# EAGLE design ETAG_v8_u2270b_AOS2017 (EAGLE 7.5.0)

## Sheet 1 of 2
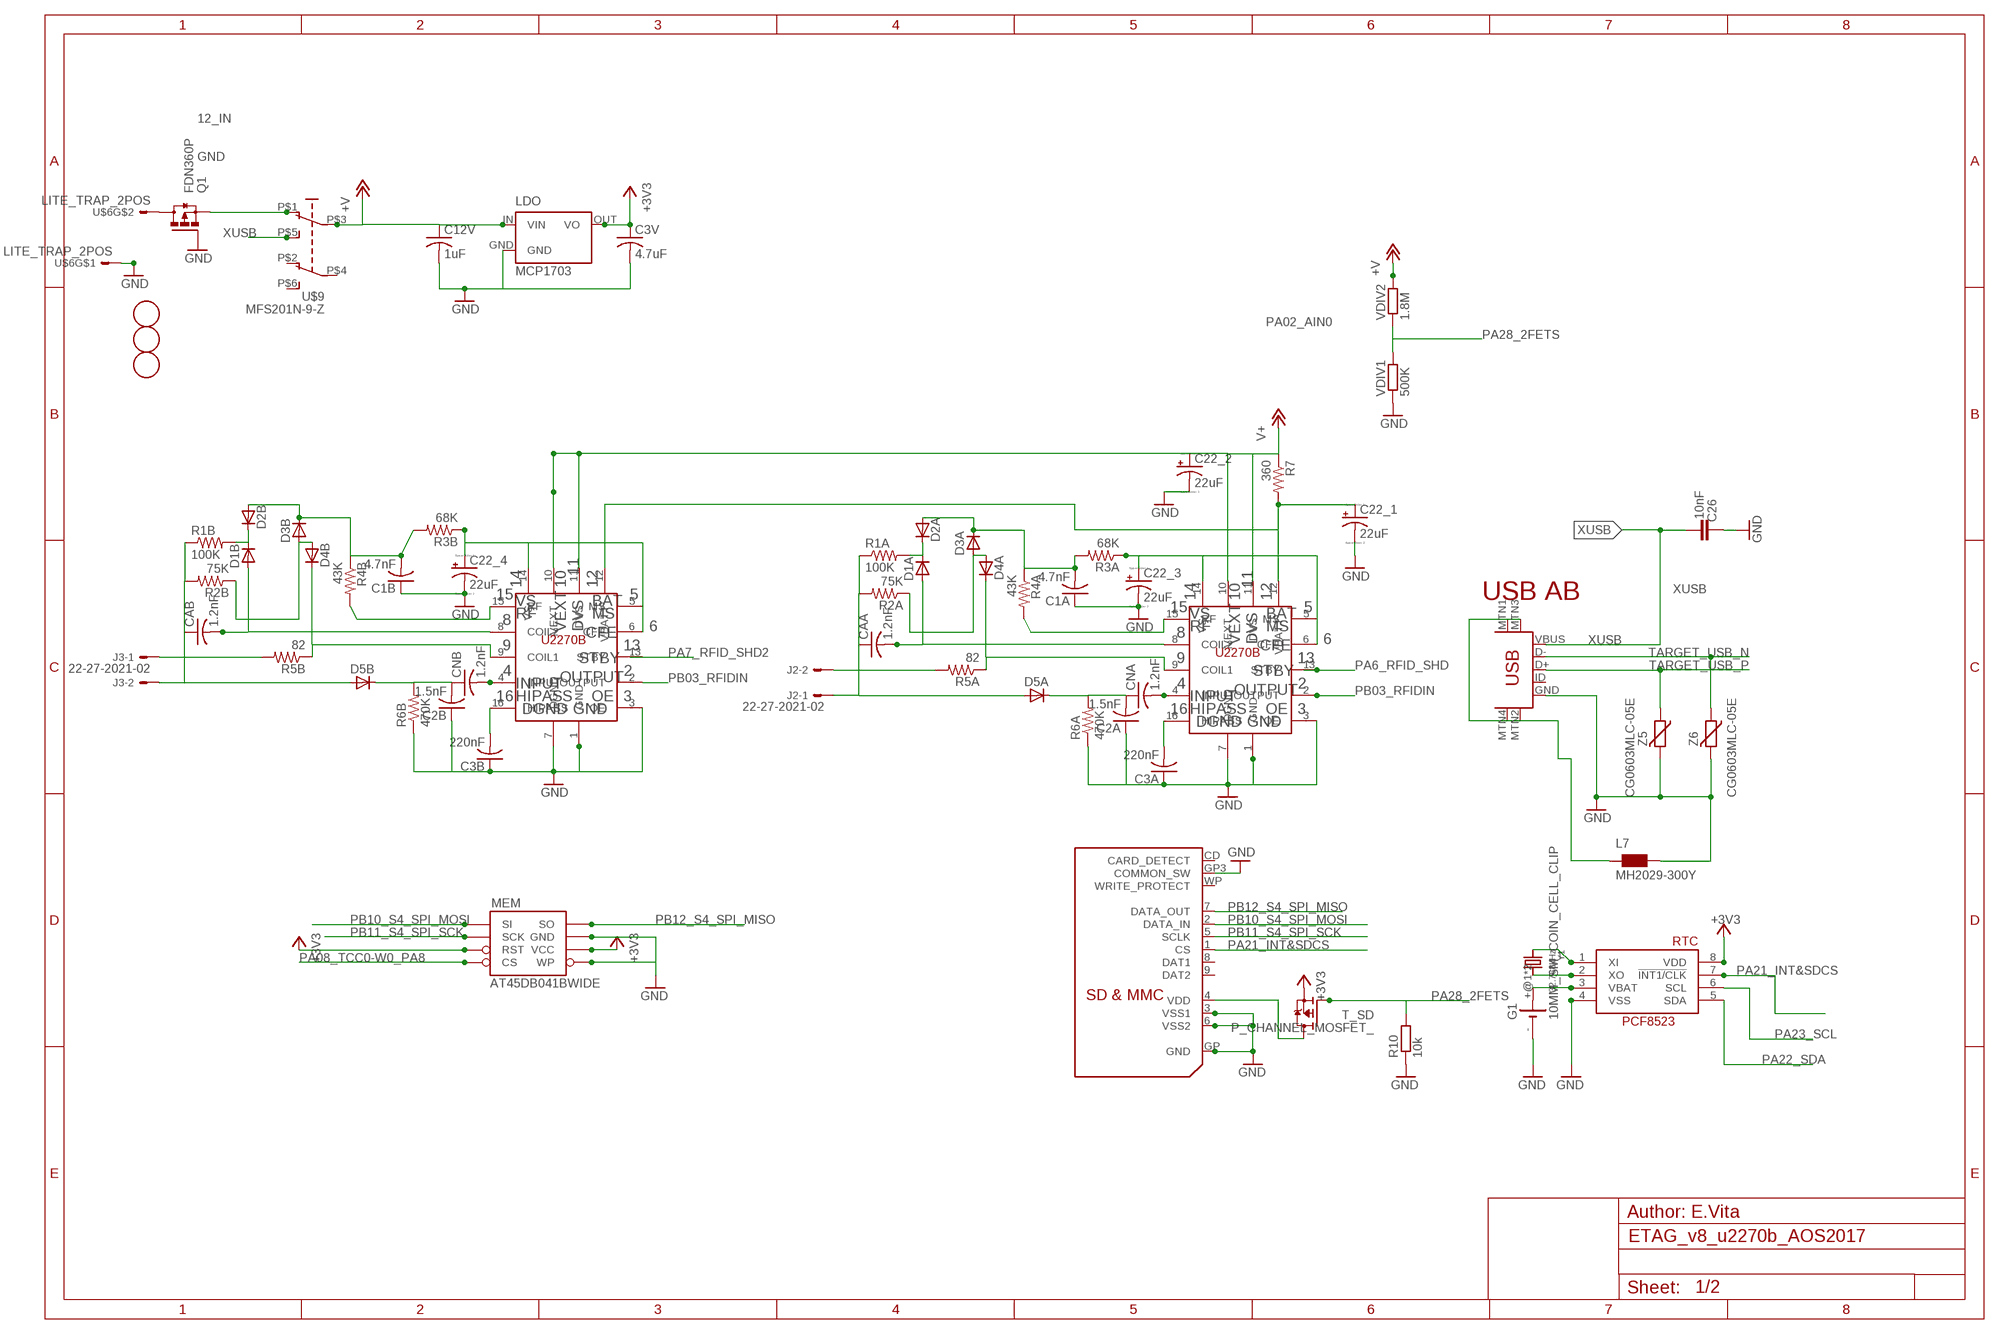
[diagram p0: schematic, sheet 1]

### Parts
C1A  4.7nF  C-US  [C0603-ROUND]
C1B  4.7nF  C-US  [C0603-ROUND]
C2A  1.5nF  C-USC0805  [C0805]
C2B  1.5nF  C-USC0805  [C0805]
C3A  220nF  C-US  [C0603-ROUND]
C3B  220nF  C-US  [C0603-ROUND]
C3V  4.7uF  C-USC0805  [C0805]
C12V  1uF  C-USC0805  [C0805]
C22_1  22uF  CPOL-US153CLV-0505  [153CLV-0505]
C22_2  22uF  CPOL-US153CLV-0505  [153CLV-0505]
C22_3  22uF  CPOL-US153CLV-0505  [153CLV-0505]
C22_4  22uF  CPOL-US153CLV-0505  [153CLV-0505]
C26  10nF  0142_10NF_0603  [C0603-ROUND]
CAA  1.2nF  C-USC0805  [C0805]
CAB  1.2nF  C-USC0805  [C0805]
CNA  1.2nF  C-USC0805  [C0805]
CNB  1.2nF  C-USC0805  [C0805]
D1A  D-GLASS_MELF  [SOT-23_2PAD]
D1B  D-GLASS_MELF  [SOT-23_2PAD]
D2A  D-GLASS_MELF  [SOT-23_2PAD]
D2B  D-GLASS_MELF  [SOT-23_2PAD]
D3A  D-GLASS_MELF  [SOT-23_2PAD]
D3B  D-GLASS_MELF  [SOT-23_2PAD]
D4A  D-GLASS_MELF  [SOT-23_2PAD]
D4B  D-GLASS_MELF  [SOT-23_2PAD]
D5A  D-GLASS_MELF  [SOT-23_2PAD]
D5B  D-GLASS_MELF  [SOT-23_2PAD]
FD1  FIDUCIALMOUNT  [FIDUCIA-MOUNT]
FD2  FIDUCIALMOUNT  [FIDUCIA-MOUNT]
FD3  FIDUCIALMOUNT  [FIDUCIA-MOUNT]
G1  10MM_SM_COIN_CELL_CLIP  [10MM_SM_COIN_CELL_CLIP]
J2  22-27-2021-02  [6410-02]
J3  22-27-2021-02  [6410-02]
L7  MH2029-300Y  0001_BLM21PG300SN1D_/_MH2029-300Y  [0805]
LDO  MCP1703  [SOT89]
MEM  AT45DB041BWIDE  [SO08WIDE]
Q1  FDN360P  [SUPER-SOT3]
R1A  100K  R-US_ROUND  [C0603-ROUND]
R1B  100K  R-US_ROUND  [C0603-ROUND]
R2A  75K  R-US_ROUND  [C0603-ROUND]
R2B  75K  R-US_ROUND  [C0603-ROUND]
R3A  68K  R-US_ROUND  [C0603-ROUND]
R3B  68K  R-US_ROUND  [C0603-ROUND]
R4A  43K  R-US_ROUND  [C0603-ROUND]
R4B  43K  R-US_ROUND  [C0603-ROUND]
R5A  82  R-US_ROUND  [C0603-ROUND]
R5B  82  R-US_ROUND  [C0603-ROUND]
R6A  470K  R-US_ROUND  [C0603-ROUND]
R6B  470K  R-US_ROUND  [C0603-ROUND]
R7  360  R-US_ROUND  [C0603-ROUND]
R10  10k  0028_CR0603JW103L  [R0603-ROUND]
RF_A  U2270B  [SO16]
RF_B  U2270B  [SO16]
RTC  RTC_PCF8523T  [SOIC8_150MIL]
T_SD  P_CHANNEL_MOSFET_  [SOT23]
U$4  SDMMC06132  [06132]
U$6  LITE_TRAP_2POS  [LITE_TRAP_MINI]
U$9  MFS201N-9-Z  [MFS201N-9-Z]
USB  USB-MINIB-5PIN  [USB-MINIB]
VDIV1  500K  2339_  [R0603-ROUND]
VDIV2  1.8M  2022_CR0603FW104L  [R0603-ROUND]
Y1  32.768kHz  CRYSTAL8.0X3.8  [CRYSTAL_8X3.8]
Z5  CG0603MLC-05E  0010_BRNCG0603MLC-05E  [CT/CN0603]
Z6  CG0603MLC-05E  0010_BRNCG0603MLC-05E  [CT/CN0603]

### Nets
2GND [gnd]: L7.1 USB.MTN1(MTN2) USB.MTN2(MTN3) USB.MTN3(MTN1) USB.MTN4
12_IN: Q1.3(D) U$6.P$3 U$6.P$4
+3V3: C3V.1 LDO.OUT(VO) MEM.3(RST) MEM.6(VCC) RTC.8(VDD) T_SD.2(S) ; also sheet 2
GND [gnd]: C1A.1 C1B.1 C2A.1 C2B.1 C3A.1 C3B.1 C3V.2 C12V.2 C22_1.- C22_2.- C22_3.- C22_4.- C26.2 G1.- L7.2 LDO.GND MEM.5(WP) MEM.7(GND) Q1.1(G) R6A.1 R6B.1 R10.1 RF_A.1(GND) RF_A.3(OE) RF_A.7(DGND) RF_B.1(GND) RF_B.3(OE) RF_B.7(DGND) RTC.4(VSS) U$4.3(VSS1) U$4.6(VSS2) U$4.GP3(COMMON_SW) U$4.GP(GND) U$6.P$1 U$6.P$2 USB.GND VDIV1.1 Z5.2 Z6.2 ; also sheet 2
N$2: RTC.2(XO) Y1.P$4
N$3: RTC.1(XI) Y1.P$1
N$4: C22_1.+ R7.2 RF_A.12(VBATT) RF_B.12(VBATT)
N$5: C3A.2 RF_A.16(HIPASS)
N$11: CNA.2 RF_A.4(INPUT)
N$12: C2A.2 CNA.1 D5A.P$1(C) R6A.2
N$13: C1A.2 D2A.P$2(A) D3A.P$1(C) R3A.2 R4A.1
N$14: J2.2 R5A.2
N$15: J3.1 R5B.2
N$17: Q1.2(S) U$9.P$1(O)
N$18: D1A.P$1(C) D2A.P$1(C) R1A.2
N$19: C3B.2 RF_B.16(HIPASS)
N$20: D3A.P$2(A) D4A.P$2(A) R2A.1
N$21: CNB.2 RF_B.4(INPUT)
N$22: C2B.2 CNB.1 D5B.P$1(C) R6B.2
N$23: D4B.P$1(C) R5B.1 RF_B.9(COIL1)
N$24: CAB.2 D1B.P$2(A) RF_B.8(COIL2)
N$25: CAB.1 D5B.P$2(A) J3.2 R1B.1 R2B.2
N$26: R4B.2 RF_B.15(RF)
N$27: C22_4.+ R3B.1 RF_B.5(MS) RF_B.6(CFE) RF_B.14(VS)
N$28: D1B.P$1(C) D2B.P$1(C) R1B.2
N$29: D3B.P$2(A) D4B.P$2(A) R2B.1
N$30: C1B.2 D2B.P$2(A) D3B.P$1(C) R3B.2 R4B.1
N$35: D4A.P$1(C) R5A.1 RF_A.9(COIL1)
N$40: CAA.2 D1A.P$2(A) RF_A.8(COIL2)
N$41: CAA.1 D5A.P$2(A) J2.1 R1A.1 R2A.2
N$43: R4A.2 RF_A.15(RF)
N$44: C22_3.+ R3A.1 RF_A.5(MS) RF_A.6(CFE) RF_A.14(VS)
PA02_AIN0: VDIV1.2 VDIV2.1 ; also sheet 2
PA6_RFID_SHD: RF_A.13(STBY) ; also sheet 2
PA7_RFID_SHD2: RF_B.13(STBY) ; also sheet 2
PA08_TCC0-W0_PA8: MEM.4(CS) ; also sheet 2
PA21_INT&SDCS: RTC.7(!INT1/CLK) U$4.1(CS) ; also sheet 2
PA22_SDA: RTC.5(SDA) ; also sheet 2
PA23_SCL: RTC.6(SCL) ; also sheet 2
PA28_2FETS: R10.2 T_SD.1(G) ; also sheet 2
PB03_RFIDIN: RF_A.2(OUTPUT) RF_B.2(OUTPUT) ; also sheet 2
PB10_S4_SPI_MOSI: MEM.1(SI) U$4.2(DATA_IN) ; also sheet 2
PB11_S4_SPI_SCK: MEM.2(SCK) U$4.5(SCLK) ; also sheet 2
PB12_S4_SPI_MISO: MEM.8(SO) U$4.7(DATA_OUT) ; also sheet 2
TARGET_USB_N [USBpair]: USB.D- Z6.1 ; also sheet 2
TARGET_USB_P [USBpair]: USB.D+ Z5.1 ; also sheet 2
V_IN: C12V.1 C22_2.+ LDO.IN(VIN) R7.1 RF_A.10(VEXT) RF_A.11(DVS) RF_B.10(VEXT) RF_B.11(DVS) U$9.P$3(P) VDIV2.2 ; supply symbol labelled V+, +V ; also sheet 2
VBAT1: G1.+@1(+) G1.+@2(+) RTC.3(VBAT)
VDD: T_SD.3(D) U$4.4(VDD)
XUSB [usbvcc]: C26.1 U$9.P$5(S) USB.VBUS
Unconnected: U$4.8(DAT1) U$4.9(DAT2) U$4.CD(CARD_DETECT) U$4.WP(WRITE_PROTECT) U$9.P$2(O1) U$9.P$4(P1) U$9.P$6(S1) USB.ID

### Notes on the sheet
- 11
- USB AB
- 14 | 10 | 12 | 11
- 15 | DVS | 5 | 14 | 10 | 12
- VS | BAT
- 15 | DVS | 5
- RF | MS | VS | BAT
- 8
- VEXT | 6 | RF | MS
- CFE | 8
- VEXT | 6
- 9 | 13 | CFE
- STBY | 9 | 13
- 4 | 2 | STBY
- OUTPUT
- INPUT | 4 | 2
- OUTPUT
- 16 | HIPASS | OE | 3 | INPUT
- DGND | GND | 16 | HIPASS | OE | 3
- DGND | GND
- Author: E.Vita

## Sheet 2 of 2
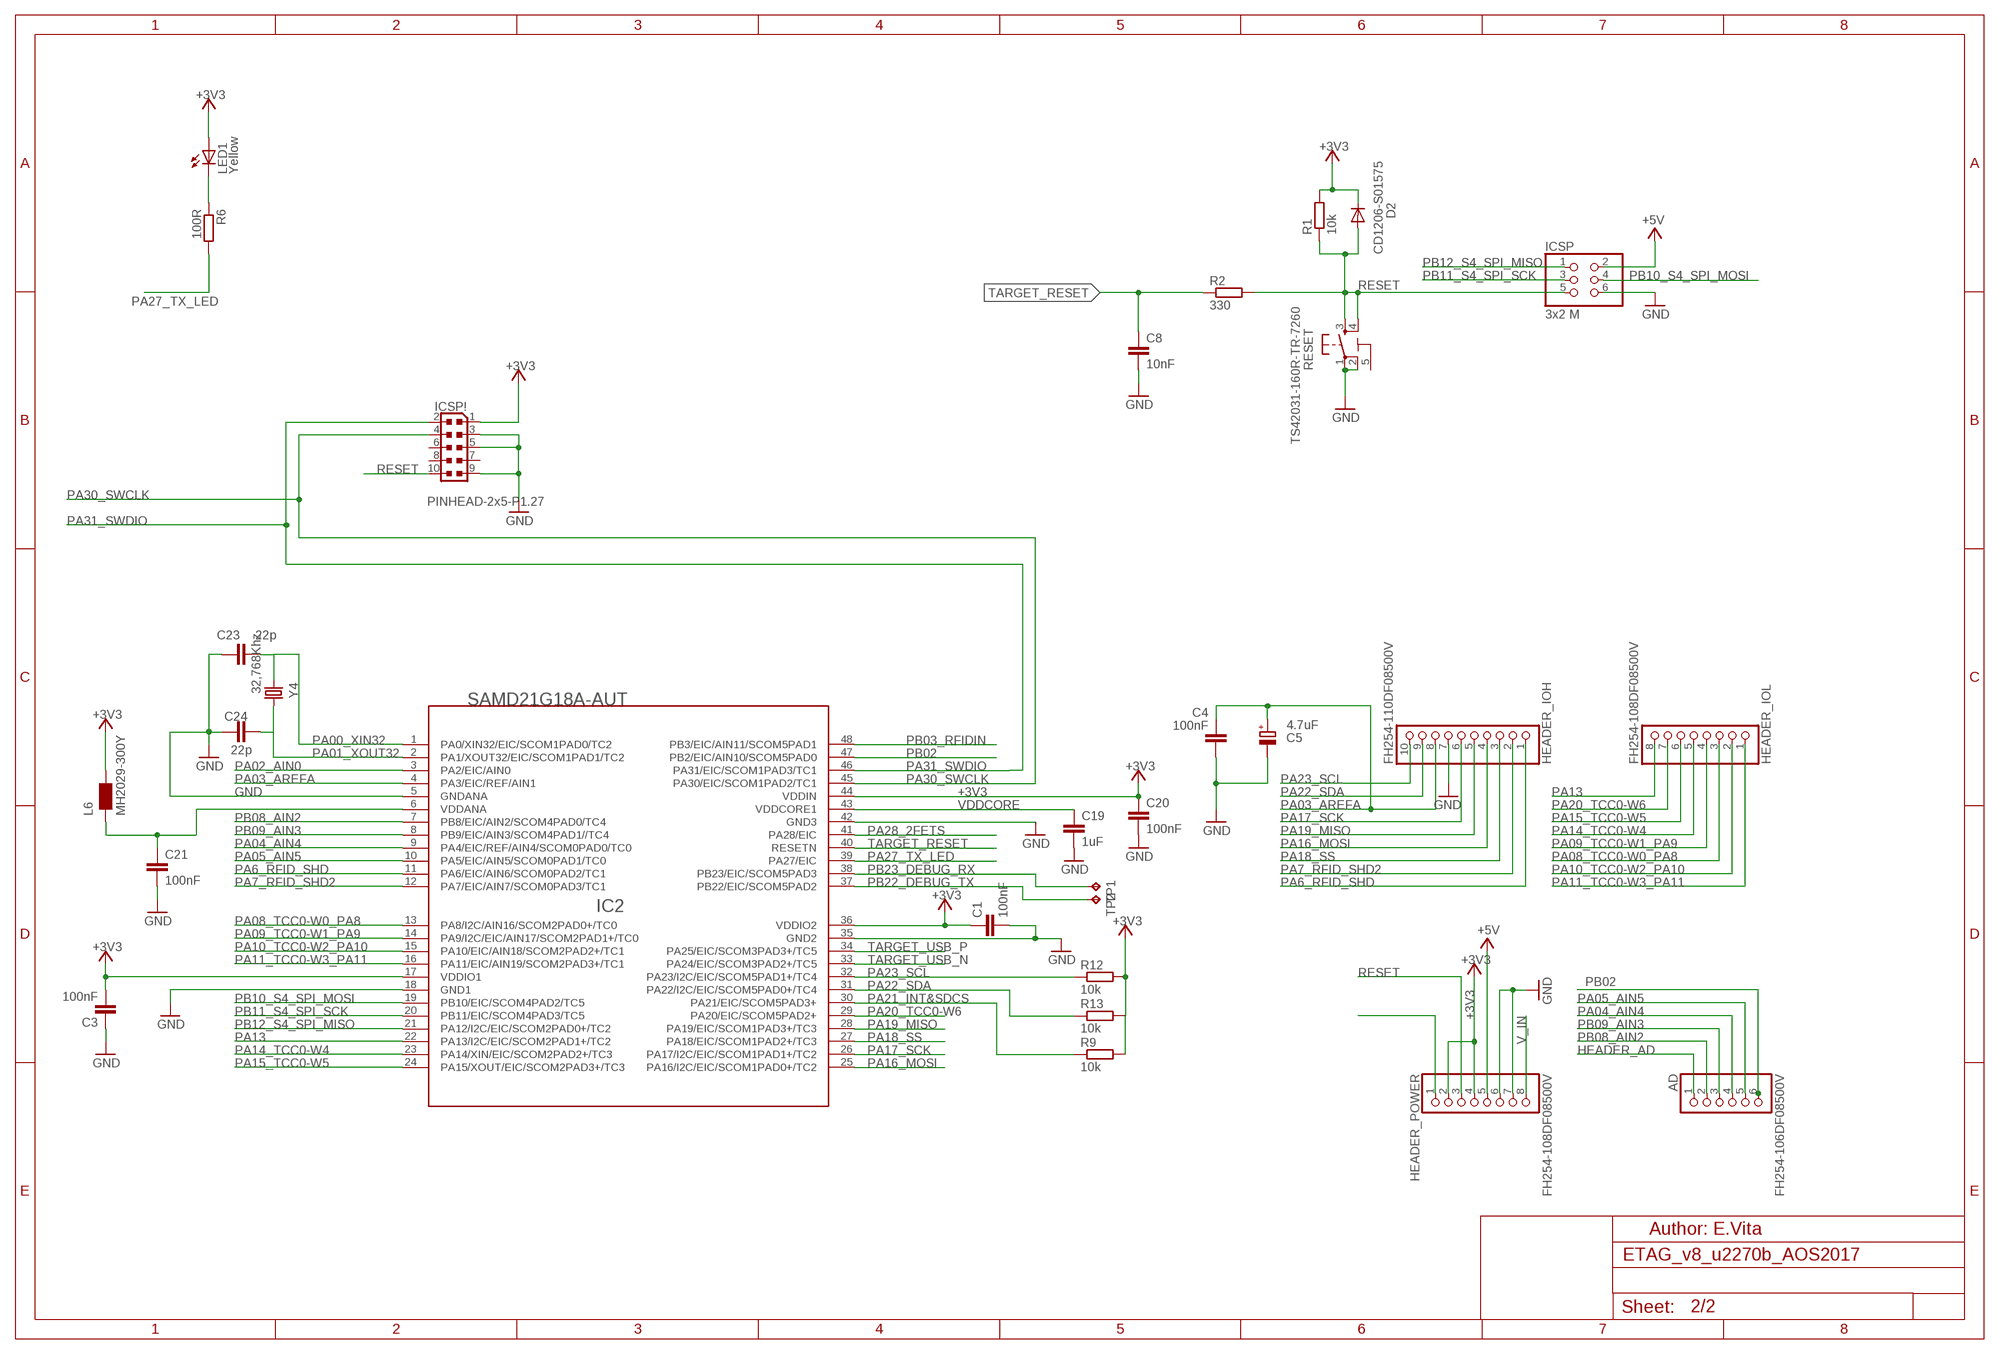
[diagram p1: schematic, sheet 2]

### Parts
AD  FH254-106DF08500V  1682_20TW-535_STD  [1X06]
C1  100nF  0015_100NF_0603  [C0603-ROUND]
C3  100nF  0015_100NF_0603  [C0603-ROUND]
C4  100nF  0015_100NF_0603  [C0603-ROUND]
C5  4.7uF  0474_TAJA475M016RNJ  [SMC_A]
C8  10nF  0142_10NF_0603  [C0603-ROUND]
C19  1uF  0006_1UF_0603/GRM188R61E105KA12D  [C0603-ROUND]
C20  100nF  0015_100NF_0603  [C0603-ROUND]
C21  100nF  0015_100NF_0603  [C0603-ROUND]
C23  22p  0014_22PF_0603  [C0603-ROUND]
C24  22p  0014_22PF_0603  [C0603-ROUND]
D2  CD1206-S01575  0012_CD1206-S01575  [MINIMELF]
HEADER_IOH  FH254-110DF08500V  1684_20TW-537  [1X10]
HEADER_IOL  FH254-108DF08500V  1683_20TW-536  [1X08]
HEADER_POWER  FH254-108DF08500V  1683_20TW-536  [1X08]
IC2  SAMD21G18A-AUT  1792_SAMD21G18A-AUT  [TQFP48-7X7]
ICSP  3x2 M  0114_PH254-203DF118A00V  [2X03]
ICSP!  PINHEAD-2x5-P1.27  0171_PH127-205DF055G00AROUND-PADS  [PINHEAD_2X05_127]
L6  MH2029-300Y  0001_BLM21PG300SN1D_/_MH2029-300Y  [0805]
LED1  Yellow  0044_KPT-2012YC  [CHIPLED_0805]
R1  10k  0028_CR0603JW103L  [R0603-ROUND]
R2  330  0049_330R_0603  [R0603-ROUND]
R6  100R  0233_0R_0603  [R0603-ROUND]
R9  10k  0028_CR0603JW103L  [R0603-ROUND]
R12  10k  0028_CR0603JW103L  [R0603-ROUND]
R13  10k  0028_CR0603JW103L  [R0603-ROUND]
RESET  TS42031-160R-TR-7260  0946_TS42031-160W-TR-7260  [TS42]
TP1  TPTP15R  [TP15R]
TP2  TPTP15R  [TP15R]
Y4  32,768Khz  0213_ABS07-32.768KHZ-T  [RESONATOR_EPSON_FC_145]

### Nets
+3V3: C1.1 C3.2 C20.1 D2.C HEADER_POWER.2 HEADER_POWER.4 IC2.17(VDDIO1) IC2.36(VDDIO2) IC2.44(VDDIN) ICSP!.1 L6.2 LED1.A R1.2 R9.2 R12.2 R13.2 ; also sheet 1
+5V [usbvcc]: HEADER_POWER.5 ICSP.2
GND [gnd]: C1.2 C3.1 C4.2 C5.- C8.2 C19.2 C20.2 C21.2 C23.1 C24.1 HEADER_IOH.7 HEADER_POWER.6 HEADER_POWER.7 IC2.5(GNDANA) IC2.18(GND1) IC2.35(GND2) IC2.42(GND3) ICSP!.3 ICSP!.5 ICSP!.9 ICSP.6 RESET.1 RESET.2 ; also sheet 1
HEADER_AD: AD.1
N$1: LED1.C R6.1
N$10: C21.1 IC2.6(VDDANA) L6.1
N$56: HEADER_POWER.1
PA00_XIN32: C23.2 IC2.1(PA0/XIN32/EIC/SCOM1PAD0/TC2) Y4.P$1
PA01_XOUT32: C24.2 IC2.2(PA1/XOUT32/EIC/SCOM1PAD1/TC2) Y4.P$2
PA02_AIN0: IC2.3(PA2/EIC/AIN0) ; also sheet 1
PA03_AREFA: C4.1 C5.+ HEADER_IOH.8 IC2.4(PA3/EIC/REF/AIN1)
PA04_AIN4: AD.4 IC2.9(PA4/EIC/REF/AIN4/SCOM0PAD0/TC0)
PA05_AIN5: AD.5 IC2.10(PA5/EIC/AIN5/SCOM0PAD1/TC0)
PA6_RFID_SHD: HEADER_IOH.1 IC2.11(PA6/EIC/AIN6/SCOM0PAD2/TC1) ; also sheet 1
PA7_RFID_SHD2: HEADER_IOH.2 IC2.12(PA7/EIC/AIN7/SCOM0PAD3/TC1) ; also sheet 1
PA08_TCC0-W0_PA8: HEADER_IOL.3 IC2.13(PA8/I2C/AIN16/SCOM2PAD0+/TC0) ; also sheet 1
PA09_TCC0-W1_PA9: HEADER_IOL.4 IC2.14(PA9/I2C/EIC/AIN17/SCOM2PAD1+/TC0)
PA10_TCC0-W2_PA10: HEADER_IOL.2 IC2.15(PA10/EIC/AIN18/SCOM2PAD2+/TC1)
PA11_TCC0-W3_PA11: HEADER_IOL.1 IC2.16(PA11/EIC/AIN19/SCOM2PAD3+/TC1)
PA13: HEADER_IOL.8 IC2.22(PA13/I2C/EIC/SCOM2PAD1+/TC2)
PA14_TCC0-W4: HEADER_IOL.5 IC2.23(PA14/XIN/EIC/SCOM2PAD2+/TC3)
PA15_TCC0-W5: HEADER_IOL.6 IC2.24(PA15/XOUT/EIC/SCOM2PAD3+/TC3)
PA16_MOSI: HEADER_IOH.4 IC2.25(PA16/I2C/EIC/SCOM1PAD0+/TC2)
PA17_SCK: HEADER_IOH.6 IC2.26(PA17/I2C/EIC/SCOM1PAD1+/TC2)
PA18_SS: HEADER_IOH.3 IC2.27(PA18/EIC/SCOM1PAD2+/TC3)
PA19_MISO: HEADER_IOH.5 IC2.28(PA19/EIC/SCOM1PAD3+/TC3)
PA20_TCC0-W6: HEADER_IOL.7 IC2.29(PA20/EIC/SCOM5PAD2+)
PA21_INT&SDCS: IC2.30(PA21/EIC/SCOM5PAD3+) R9.1 ; also sheet 1
PA22_SDA: HEADER_IOH.9 IC2.31(PA22/I2C/EIC/SCOM5PAD0+/TC4) R13.1 ; also sheet 1
PA23_SCL: HEADER_IOH.10 IC2.32(PA23/I2C/EIC/SCOM5PAD1+/TC4) R12.1 ; also sheet 1
PA27_TX_LED: IC2.39(PA27/EIC) R6.2
PA28_2FETS: IC2.41(PA28/EIC) ; also sheet 1
PA30_SWCLK: IC2.45(PA30/EIC/SCOM1PAD2/TC1) ICSP!.4
PA31_SWDIO: IC2.46(PA31/EIC/SCOM1PAD3/TC1) ICSP!.2
PB02: AD.6 IC2.47(PB2/EIC/AIN10/SCOM5PAD0)
PB03_RFIDIN: IC2.48(PB3/EIC/AIN11/SCOM5PAD1) ; also sheet 1
PB08_AIN2: AD.2 IC2.7(PB8/EIC/AIN2/SCOM4PAD0/TC4)
PB09_AIN3: AD.3 IC2.8(PB9/EIC/AIN3/SCOM4PAD1//TC4)
PB10_S4_SPI_MOSI: IC2.19(PB10/EIC/SCOM4PAD2/TC5) ICSP.4 ; also sheet 1
PB11_S4_SPI_SCK: IC2.20(PB11/EIC/SCOM4PAD3/TC5) ICSP.3 ; also sheet 1
PB12_S4_SPI_MISO: IC2.21(PA12/I2C/EIC/SCOM2PAD0+/TC2) ICSP.1 ; also sheet 1
PB22_DEBUG_TX: IC2.37(PB22/EIC/SCOM5PAD2) TP2.TP
PB23_DEBUG_RX: IC2.38(PB23/EIC/SCOM5PAD3) TP1.TP
RESET: D2.A HEADER_POWER.3 ICSP!.10 ICSP.5 R1.1 R2.2 RESET.3 RESET.4
TARGET_RESET: C8.1 IC2.40(RESETN) R2.1
TARGET_USB_N [USBpair]: IC2.33(PA24/EIC/SCOM3PAD2+/TC5) ; also sheet 1
TARGET_USB_P [USBpair]: IC2.34(PA25/EIC/SCOM3PAD3+/TC5) ; also sheet 1
V_IN: HEADER_POWER.8 ; also sheet 1
VDDCORE: C19.1 IC2.43(VDDCORE1)
Unconnected: ICSP!.6 ICSP!.7 ICSP!.8

### Notes on the sheet
- Author: E.Vita

## Power pins joined to a net without a drawn wire
5-GND: RESET.5(5-GND)

## Library data of the parts
AD = Connettori:1682_20TW-535: Female Gray Connector strip for Arduino 3V3 bases - 6x1 F V h 8,5 p2,54; MONTHLY_USAGE: 86722.85; PART_NUMBER: 20TW-535; PRICE: _0.03; SUPPLIER: CBC_elettronica__s.r.l.; TYPE: Connettori
C1 C3 C4 C20 C21 = Condensatori:0015_100NF_0603: 100nF 0603 50V; CASE: 0603; MONTHLY_USAGE: _____; PART_NUMBER: cl10b104kbnc; PRICE: _____; SUPPLIER: _____; TYPE: Condensatori
C1A C1B C2A C2B C3A C3B C3V C12V CAA CAB CNA CNB = rcl:C-US: CAPACITOR, American symbol
C5 = Condensatori:0474_TAJA475M016RNJ: 4u7 tantalio Case A - testa gialla -Tantalio; CASE: CaseA_(1206); MONTHLY_USAGE: _____; PART_NUMBER: TAJA475M016RNJ; PRICE: _____; SUPPLIER: _____; TYPE: Condensatori; VALUE: 4u7
C8 C26 = Condensatori:0142_10NF_0603: 10nF 0603; CASE: 0603; MONTHLY_USAGE: _____; PART_NUMBER: 10nF_0603; PRICE: _____; SUPPLIER: _____; TYPE: Condensatori
C19 = Condensatori:0006_1UF_0603/GRM188R61E105KA12D: 1uF 0603; CASE: 0603; MONTHLY_USAGE: _____; PART_NUMBER: 1uF_0603/GRM188R61E105KA12D; PRICE: _____; SUPPLIER: _____; TYPE: Condensatori
C22_1-C22_4 = resistor:CPOL-US: POLARIZED CAPACITOR, American symbol
C23 C24 = Condensatori:0014_22PF_0603: 22pF 0603; CASE: 0603; MONTHLY_USAGE: _____; PART_NUMBER: 22pF_0603; PRICE: _____; SUPPLIER: _____; TYPE: Condensatori
D1A D1B D2A D2B D3A D3B D4A D4B D5A D5B = semicon-smd-ipc:D-: DIODE unfilled
D2 = Diodi:0012_CD1206-S01575: small-signal high-speed Switching Diodes CD1206; CASE: 1206; MONTHLY_USAGE: _____; PART_NUMBER: CD1206-S01575; PRICE: _____; SUPPLIER: _____; TYPE: Diodi
FD1-FD3 = SmartPrj:FIDUCIALMOUNT
G1 = battery:10MM_SM_COIN_CELL_CLIP: Battery cell clip for CR927 Source: KEYSTONE ELECTRONICS CORP. www.keyelco.com, ASTORIA, N.Y. 11105-2017 PART ANME 10mm SM COIN CELl CLIP DWG NO. 3030
HEADER_IOH = Connettori:1684_20TW-537: Female Gray Connector strip for Arduino 3V3 bases - 10x1 F V h 8,5 p2,54mm; MONTHLY_USAGE: _____; PART_NUMBER: 20TW-537; PRICE: _____; SUPPLIER: _____; TYPE: Connettori
HEADER_IOL HEADER_POWER = Connettori:1683_20TW-536: Female Gray Connector strip for Arduino 3V3 bases - 8x1 F V h 8,5 p2,54mm; MONTHLY_USAGE: _____; PART_NUMBER: 20TW-536; PRICE: _____; SUPPLIER: _____; TYPE: Connettori
IC2 = IntegratedCircuits:1792_SAMD21G18A-AUT: Atmel D21 32bit ARM Cortex-M0 microcontroller - 48 PIN TQFP 256KB flash memory + 32KB SRAM
ICSP = Connettori:0114_PH254-203DF118A00V: 3x2 M V h 8,5 mm p2,54; MONTHLY_USAGE: _____; PART_NUMBER: PH254-203DF118A00V; PRICE: _____; SUPPLIER: _____; TYPE: Connettori; VALUE: ICSP
ICSP! = Connettori:0171_PH127-205DF055G00A: 2x5 PASSO 1,27
J2 J3 = con-molex:22-?-02: CONNECTOR wire to board 2.54 mm (.1 inch) pitch header; OC_FARNELL: unknown; OC_NEWARK: unknown
L6 L7 = Protezione:0001_BLM21PG300SN1D_/_MH2029-300Y: BLM21; MONTHLY_USAGE: _____; PART_NUMBER: BLM21PG300SN1D_/_MH2029-300Y; PRICE: _____; SUPPLIER: _____; TYPE: Protezione
LDO = microchip:MCP1703
LED1 = Opto:0044_KPT-2012YC: LED YELLOW - SMD - 0805; MONTHLY_USAGE: _____; PART_NUMBER: KPT-2012YC; PRICE: _____; SUPPLIER: _____; TYPE: Opto
MEM = SparkFun-DigitalIC:AT45DB041B: 4-Mbit SPI flash memory
Q1 = transistor-power:FDN360P: Single P-Channel, PowerTrench (R) MOSFET Source: http://www.fairchildsemi.com/ds/FD/FDN360P.pdf
R1 R9 R10 R12 R13 = Resistenze:0028_CR0603JW103L: 10K 0603; CASE: 0603; MONTHLY_USAGE: _____; PART_NUMBER: CR0603JW103L; PRICE: _____; SUPPLIER: _____; TYPE: Resistenze
R1A R1B R2A R2B R3A R3B R4A R4B R5A R5B R6A R6B R7 = rcl:R-US_: RESISTOR, American symbol
R2 = Resistenze:0049_330R_0603: 330R 0603; CASE: 0603; MONTHLY_USAGE: _____; PART_NUMBER: 330R_0603; PRICE: _____; SUPPLIER: _____; TYPE: Resistenze; VALUE: 330R
R6 = Resistenze:0233_0R_0603: 0R 0603; CASE: 0603; MONTHLY_USAGE: _____; PART_NUMBER: 0R_0603; PRICE: _____; SUPPLIER: _____; TYPE: Resistenze; VALUE: 0R
RESET = Switches:0946_TS42031-160W-TR-7260: Pushbutton 6x6 Smd - White; MONTHLY_USAGE: _____; PART_NUMBER: IT-1157AHNP-160G-G_GTR; PRICE: _____; SUPPLIER: _____; TYPE: Switches; VALUE: TS42
RF_A RF_B = atmel:U2270B
RTC = microbuilder:RTC_PCF8523
T_SD = transistor-fet:P_CHANNEL_MOSFET_
TP1 TP2 = testpad:TP: Test pad
U$4 = microbuilder:SDMMC: SD MMC Card holder 4UCON part #06132 - easy to solder
U$6 = con-molex:LITE_TRAP_2POS
U$9 = switch:MFS201N-9-Z
USB = USB_miniB:USB-MINIB
VDIV1 = Resistenze:2339_: 19K1 0,1% 0603; CASE: 0603; MONTHLY_USAGE: _____; PRICE: _____; SUPPLIER: _____; TYPE: Resistenze; VALUE: 19K1_0,1%
VDIV2 = Resistenze:2022_CR0603FW104L: 0603 Resistor 100K 1%; PART_NUMBER: CR0603FW104L; VALUE: 100K_1%
Y1 = microbuilder:CRYSTAL: Crystals HC49UP - Surface Mount Crystal 4.0MHz 18pF +/-30ppm Surface Mount Crystal [Digikey: 535-9857-1-ND] 12.0 MHz Surface Mount Crystal [Digikey: 535-9869-6-ND] 25.0 MHz Surface Mount Crystal [Digikey: 535-9078-1-ND] 2.5 x 2.0mm - MEMs SMT Crystal 16.0 MHz 10pF 20ppm 2.5 x 2.0mm Crystal [Digikey -40-85°C: 535-10923-1-ND] 3.2 x 2.5mm - MEMs SMT Crystal 12.0 MHz 8pF 15ppm 3.2 x 2.5mm Crystal [Digikey: -10-70°C: 644-1047-1-ND -40-125°C: 644-1128-1-ND] 40~85°C cheaper: 644-1173-6-ND 16.0 MHz 8pF 15ppm 3.2 x 2.5mm Crystal [Digikey: -10-70°C: 644-1049-1-ND -40-125°C: 644-1129-2-ND]-40~85°C cheaper: 644-1175-6-ND 16.0 MHz 10pF 10ppm 3.2 x 2.5mm Crystal [Digikey: 644-1100-1-ND] 27.12 MHz 18pF 30ppm 3.2 x 2.5mm Crystal [Digikey: 887-1424-1-ND] 27.12MHz 10pF 10ppm 3.2 x 2.5mm Crystal [Digikey: 887-1329-1-ND] 4.9 x 1.8mm - MEMs SMT Crystal 32.768 KHz 12.5pF 20ppm 4.9 x 1.8mm Crystal [Digikey: SE2415CT-ND] 8.0 x 3.8mm - Surface Mount Crystal 32.768kHz 12.5pF 20ppm -40°C-85°C [Digikey: 535-9166-2-ND] Cylinder 32.768KHz Cylinder Crystal (2x6mm body) [Ex. Digikey: 300-8341-2-ND]
Y4 = Cristalli:0213_ABS07-32.768KHZ-T: 32,768KHz - SMD; MONTHLY_USAGE: _____; PART_NUMBER: ABS07-32.768KHZ-T; PRICE: _____; SUPPLIER: _____; TYPE: Cristalli; VALUE: 32,768Khz_SMD
Z5 Z6 = Protezione:0010_BRNCG0603MLC-05E: CG0603MLC-05E; MONTHLY_USAGE: _____; PART_NUMBER: BRNCG0603MLC-05E; PRICE: _____; SUPPLIER: _____; TYPE: Protezione; VALUE: BRNCG0603MLC-05E

## Net classes
1 USB: width 0.203 mm, drill 0.305 mm, clearance 0.178 mm
2 gnd: width 0.254 mm, drill 0.254 mm, clearance 0.178 mm
3 usbvcc: width 0.203 mm, drill 0.406 mm, clearance 0.178 mm
4 USBpair: width 0.254 mm, drill 0.406 mm, clearance 0.406 mm

## Board
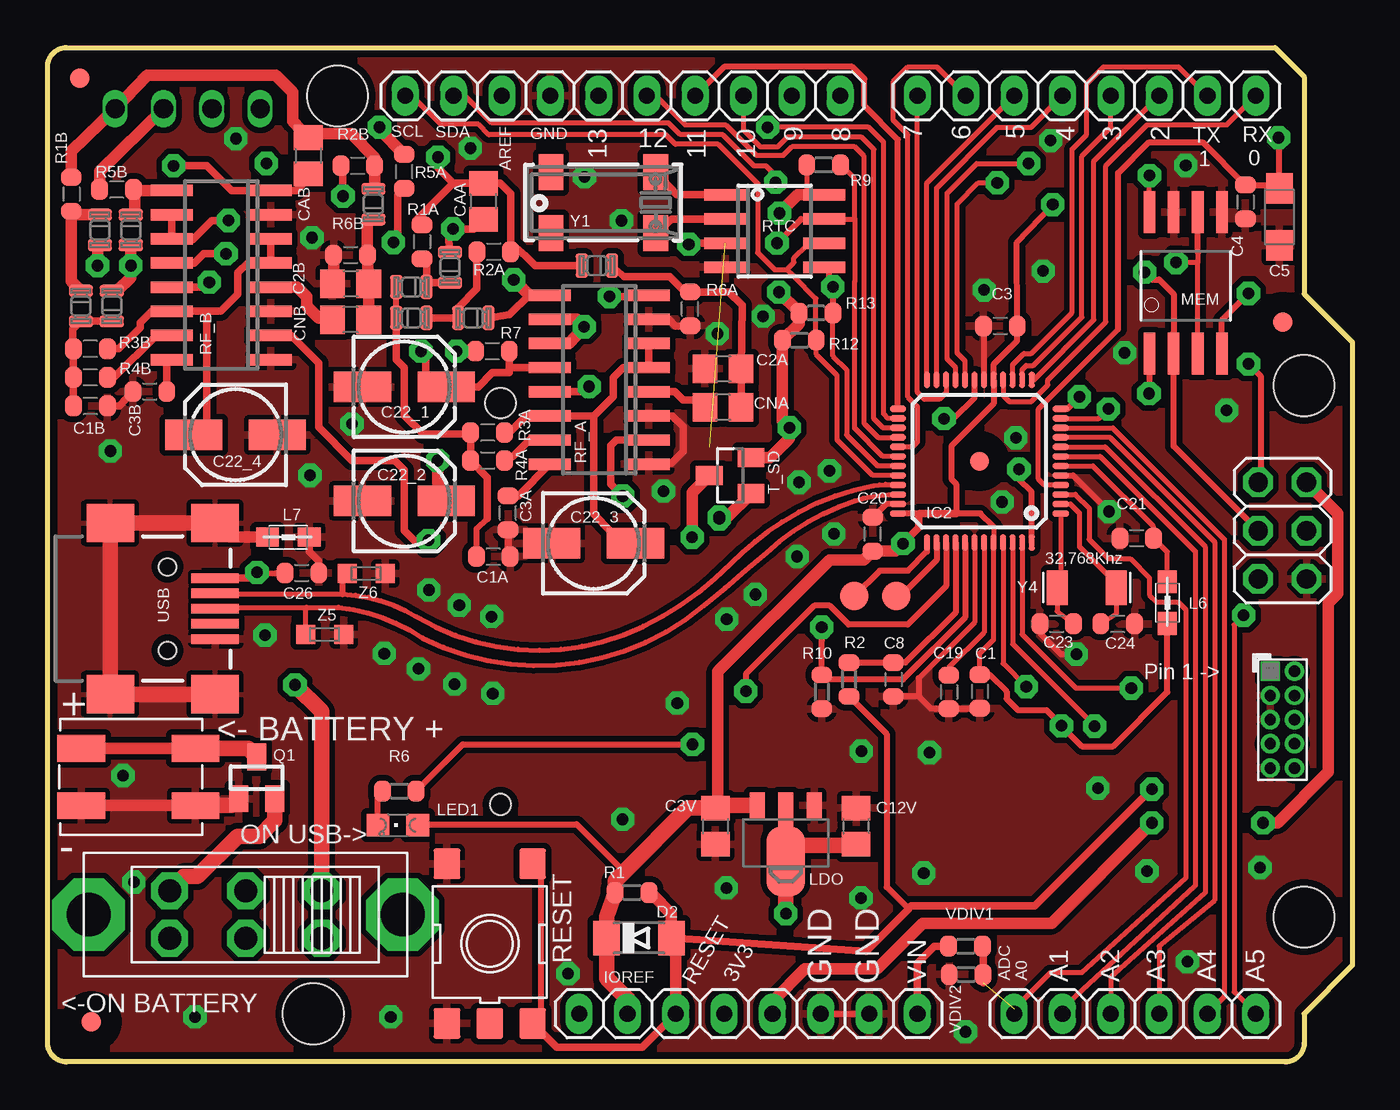
[diagram p2: board, top side]
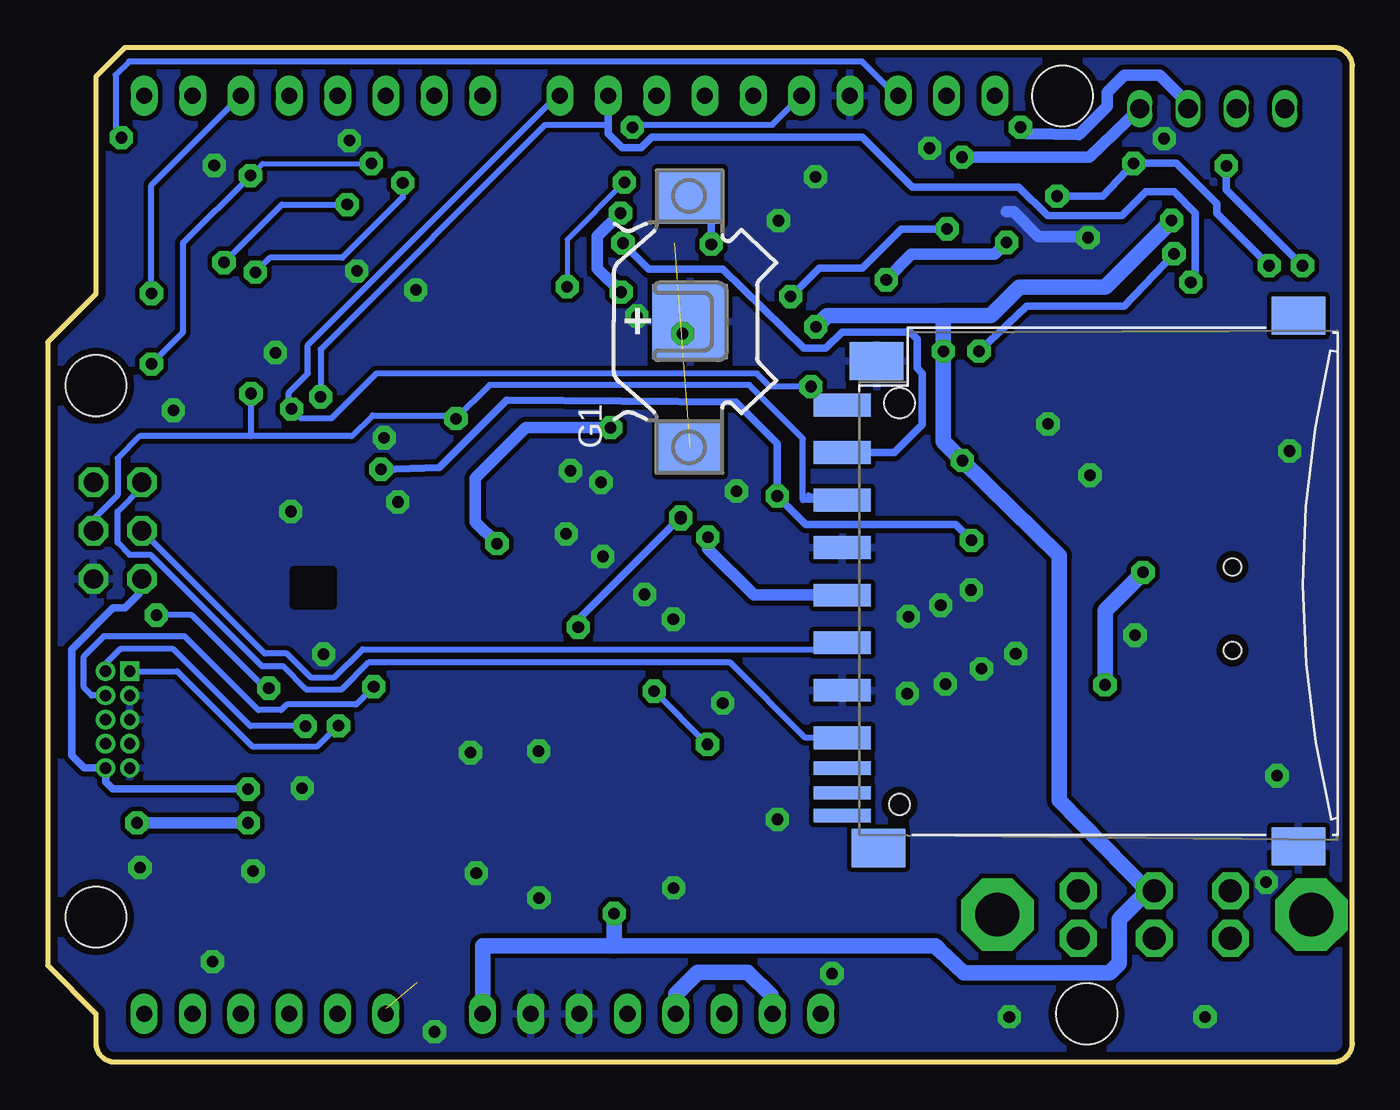
[diagram p3: board, bottom side, seen from below]

Size 68.58 x 53.34 mm. Coordinates in mm from the lower left corner, seen from the top.
Outline: 64.52,53.34 66.04,51.82 66.04,40.39 68.58,37.85 68.58,5.08 66.04,2.54 66.04,1 arc-90 65.04,0 1,0 arc-90 0,1 0,52.34 arc-90 1,53.34 64.52,53.34
Copper layers (1*2+15*16): Top 0.035mm / dielectric 0.5mm / layer 2 0.035mm / dielectric 0.4mm / layer 15 0.035mm / dielectric 0.5mm / Bottom 0.035mm
Design rules "ArduinoUno *": minimum track width 6mil, minimum drill 16mil, track to track 6mil, track to pad 6mil, pad to pad 4mil, via to via 6mil, smd to smd 4mil, copper to edge 15mil, drill to drill 10mil, minimum pad ring 6mil, minimum via ring 4.5mil, stop-mask expansion 1mil, vias tented up to drill 32mil, thermal gap 10mil
Holes 3.2 mm at 66.04,35.56 66.04,7.62 15.24,50.8 13.97,2.54
vRestrict: area 42.2,47.2 to 43.3,48.8; area 48.3,47.5 to 49.5,48.9; area 47.6,47.4 to 48.8,48.9; area 50.2,47.4 to 51.3,48.9; area 44.7,47.2 to 45.8,48.8

### Footprints (pad centres in the part's own frame; a part is rotated, then mirrored left to right if it is on the bottom)
1X06 = drill 0.85 pad 1.422 long: 1 -6.35,0; 2 -3.81,0; 3 -1.27,0; 4 1.27,0; 5 3.81,0; 6 6.35,0
C0603-ROUND = smd 0.898 x 1.1: 1 -0.889,0; 2 0.889,0
C0805 = smd 1.3 x 1.5: 1 -0.95,0; 2 0.95,0
SMC_A = smd 1.6 x 1.4: + -1.5,0; - 1.5,0
153CLV-0505 = smd 3 x 1.6: + 2.2,0; - -2.2,0
SOT-23_2PAD = smd 0.635 x 1.27: P$1 -0.8,0; P$2 0.8,0
MINIMELF = smd 1.4 x 1.8: A 1.7,0; C -1.7,0
FIDUCIA-MOUNT = smd 1.016 x 1.016: P$1 0,0
10MM_SM_COIN_CELL_CLIP = smd 2.9 x 3.5: +@1 -6.6,0; +@2 6.6,0 | smd 3.96 x 3.96: - 0,0
1X10 = drill 0.85 pad 1.422 long: 1 -11.43,0; 2 -8.89,0; 3 -6.35,0; 4 -3.81,0; 5 -1.27,0; 6 1.27,0; 7 3.81,0; 8 6.35,0; 9 8.89,0; 10 11.43,0
1X08 = drill 0.85 pad 1.422 long: 1 -8.89,0; 2 -6.35,0; 3 -3.81,0; 4 -1.27,0; 5 1.27,0; 6 3.81,0; 7 6.35,0; 8 8.89,0
TQFP48-7X7 = smd 0.85 x 0.32: 1 -4.275,2.75; 2 -4.275,2.25; 3 -4.275,1.75; 4 -4.275,1.25; 5 -4.275,0.75; 6 -4.275,0.25; 7 -4.275,-0.25; 8 -4.275,-0.75; 9 -4.275,-1.25; 10 -4.275,-1.75; 11 -4.275,-2.25; 12 -4.275,-2.75; 25 4.275,-2.75; 26 4.275,-2.25; 27 4.275,-1.75; 28 4.275,-1.25; 29 4.275,-0.75; 30 4.275,-0.25; 31 4.275,0.25; 32 4.275,0.75; 33 4.275,1.25; 34 4.275,1.75; 35 4.275,2.25; 36 4.275,2.75 | smd 0.32 x 0.85: 13 -2.75,-4.275; 14 -2.25,-4.275; 15 -1.75,-4.275; 16 -1.25,-4.275; 17 -0.75,-4.275; 18 -0.25,-4.275; 19 0.25,-4.275; 20 0.75,-4.275; 21 1.25,-4.275; 22 1.75,-4.275; 23 2.25,-4.275; 24 2.75,-4.275; 37 2.75,4.275; 38 2.25,4.275; 39 1.75,4.275; 40 1.25,4.275; 41 0.75,4.275; 42 0.25,4.275; 43 -0.25,4.275; 44 -0.75,4.275; 45 -1.25,4.275; 46 -1.75,4.275; 47 -2.25,4.275; 48 -2.75,4.275 | smd 1 x 1: P$1 0,0
2X03 = drill 1.016 pad 1.55 octagon: 1 -2.54,-1.27; 2 -2.54,1.27; 3 0,-1.27; 4 0,1.27; 5 2.54,-1.27; 6 2.54,1.27
PINHEAD_2X05_127 = drill 0.6 pad 1.016 square: 1 -0.635,2.54 | drill 0.6 pad 1.016: 2 0.635,2.54; 3 -0.635,1.27; 4 0.635,1.27; 5 -0.635,0; 6 0.635,0; 7 -0.635,-1.27; 8 0.635,-1.27; 9 -0.635,-2.54; 10 0.635,-2.54
6410-02 = drill 1.016 long: 1 1.27,0; 2 -1.27,0
0805 = smd 1.2 x 1: 1 -1.1,0; 2 1.1,0
SOT89 = smd 2.032 x 3.65: _IN 0,0.94 | smd 0.8 x 1.4: GND -1.499,-1.981; OUT 1.499,-1.981 | smd 0.8 x 1.9: IN 0,-1.727
CHIPLED_0805 = smd 1.2 x 1.2: A 0,-1.05; C 0,1.05
SO08WIDE = smd 0.61 x 2.21: 1 -1.905,-3.569; 2 -0.635,-3.569; 3 0.635,-3.569; 4 1.905,-3.569; 5 1.905,3.886; 6 0.635,3.886; 7 -0.635,3.886; 8 -1.905,3.886
SUPER-SOT3 = smd 1 x 1.4: 1 -0.95,-1.1; 2 0.95,-1.1; 3 0,1.1
R0603-ROUND = smd 0.898 x 1.1: 1 -0.889,0; 2 0.889,0
TS42 = smd 1.6 x 1.4: 1 -4.2,2.25; 2 4.2,2.25; 3 -4.2,-2.25; 4 4.2,-2.25; 5 -4.2,0
SO16 = smd 0.6 x 2.2: 1 -4.445,-2.6; 2 -3.175,-2.6; 3 -1.905,-2.6; 4 -0.635,-2.6; 5 0.635,-2.6; 6 1.905,-2.6; 7 3.175,-2.6; 8 4.445,-2.6; 9 4.445,2.6; 10 3.175,2.6; 11 1.905,2.6; 12 0.635,2.6; 13 -0.635,2.6; 14 -1.905,2.6; 15 -3.175,2.6; 16 -4.445,2.6
SOIC8_150MIL = smd 0.6 x 2.2: 1 -1.905,-2.6; 2 -0.635,-2.6; 3 0.635,-2.6; 4 1.905,-2.6; 5 1.905,2.6; 6 0.635,2.6; 7 -0.635,2.6; 8 -1.905,2.6
SOT23 = smd 1 x 1.4: 1 -0.95,-1.1; 2 0.95,-1.1; 3 0,1.1
TP15R = smd 1.5 x 1.5: TP 0,0
06132 = smd 1.2 x 3: 1 6.9,0.9; 2 4.4,0.9; 3 1.9,0.9; 4 -0.6,0.9; 5 -3.1,0.9; 6 -5.6,0.9; 7 -8.1,0.9; 9 9.4,0.9 | smd 0.7 x 3: 8 -9.7,0.9; CD -11,0.9; WP -12.2,0.9 | smd 2 x 2.8: GP -13.8,-23.07; GP2 14.1,-23.07; GP3 11.7,-0.9; GP4 -13.9,-1 | hole 1.1: -11.6,-2.1 | hole 1.6: 9.5,-2.1
LITE_TRAP_MINI = smd 2.5 x 1.4: P$1 -3,1.5; P$2 3,1.5; P$3 -3,-1.5; P$4 3,-1.5
MFS201N-9-Z = drill 1.2 pad 1.93 octagon: P$1 -4,1.25; P$2 -4,-1.25; P$3 0,1.25; P$4 0,-1.25; P$5 4,1.25; P$6 4,-1.25 | drill 2.3 pad 3.81 octagon: P$7 -8.25,0; P$8 8.25,0
USB-MINIB = smd 2.5 x 0.5: D+ 2.5,0; D- 2.5,0.8; GND 2.5,-1.6; ID 2.5,-0.8; VBUS 2.5,1.6 | smd 2.5 x 2: MTN1 -3,4.5; MTN2 2.5,4.5; MTN3 -3,-4.5; MTN4 2.5,-4.5 | hole 0.9: 0,2.2; 0,-2.2
CRYSTAL_8X3.8 = smd 1.3 x 1.9: P$1 -2.75,-1.6; P$2 2.75,-1.6; P$3 2.75,1.6; P$4 -2.75,1.6
RESONATOR_EPSON_FC_145 = smd 1.1 x 1.8: P$1 -1.55,0; P$2 1.55,0
CT/CN0603 = smd 1 x 1: 1 -1,0; 2 1,0

### Placement (x,y rotation side)
AD  57.15,2.54 0 top
C1  48.99,19.48 270 top
C1A  23.43,26.57 180 top
C1B  2.25,34.5 180 top
C2A  35.5,36.45 0 top
C2B  15.93,40.92 0 top
C3  50.07,38.7 0 top
C3A  24.2,28.88 90 top
C3B  5.38,35.25 0 top
C3V  35.1,12.4 270 top
C4  62.95,45.22 270 top
C5  64.74,44.43 270 top
C8  44.45,20.11 270 top
C12V  42.5,12.4 90 top
C19  47.37,19.46 270 top
C20  43.37,27.75 90 top
C21  57.24,27.54 180 top
C22_1  18.75,35.5 0 top
C22_2  18.75,29.5 0 top
C22_3  28.7,27.27 0 top
C22_4  9.88,32.98 180 top
C23  53.04,23.04 0 top
C24  56.24,23.04 180 top
C26  13.37,25.71 0 top
CAA  22.9,45.25 270 top
CAB  13.7,47.65 270 top
CNA  35.5,34.42 180 top
CNB  15.93,39.02 180 top
D1A  21.15,41.77 90 top
D1B  2.75,43.75 270 top
D2  31.08,6.52 0 top
D2A  19.12,40.75 180 top
D2B  1.75,39.75 270 top
D3A  19.12,39.12 0 top
D3B  3.38,39.75 90 top
D4A  22.38,39.12 180 top
D4B  4.38,43.75 270 top
D5A  28.88,41.88 180 top
D5B  17.12,45.1 90 top
FD1  1.7,51.73 180 top
FD2  2.31,2.13 0 top
FD3  64.92,38.89 0 top
G1  34.81,38.93 90 bottom
HEADER_IOH  30.23,50.8 180 top
HEADER_IOL  54.61,50.8 180 top
HEADER_POWER  36.83,2.54 0 top
IC2  48.97,31.59 180 top
ICSP  64.9,27.94 270 top
ICSP!  64.9,18 0 top
J2  9.91,50.12 0 top
J3  4.83,50.12 0 top
L6  58.86,24.15 270 top
L7  12.66,27.6 0 top
LDO  38.8,11.5 180 top
LED1  18.41,12.45 90 top
MEM  59.82,40.81 0 top
Q1  10.99,14.94 0 top
R1  30.71,8.91 180 top
R1A  19.68,43.12 270 top
R1B  1.25,45.62 270 top
R2  42.13,20.11 270 top
R2A  23.45,42.6 0 top
R2B  16.3,47.12 0 top
R3A  23.12,33.1 180 top
R3B  2.25,37.5 180 top
R4A  23.12,31.62 0 top
R4B  2.25,36 0 top
R5A  18.75,46.83 90 top
R5B  3.62,45.88 180 top
R6  18.49,14.24 0 top
R6A  33.77,39.6 90 top
R6B  15.93,42.42 0 top
R7  23.38,37.38 0 top
R9  40.79,47.16 180 top
R10  40.69,19.46 90 top
R12  39.51,37.95 180 top
R13  40.39,39.38 180 top
RESET  23.24,6.22 90 top
RF_A  29,35.88 90 top
RF_B  9.12,41.38 90 top
RTC  38.21,43.69 270 top
T_SD  35.87,30.84 90 top
TP1  44.6,24.5 0 top
TP2  42.4,24.5 0 top
U$4  25.91,25.15 90 bottom
U$6  4.77,14.99 180 top
U$9  10.41,7.75 0 top
USB  6.3,23.84 0 top
VDIV1  48.28,4.6 0 top
VDIV2  48.25,6.09 180 top
Y1  29.21,45.19 180 top
Y4  54.61,24.94 0 top
Z5  14.56,22.48 0 top
Z6  16.75,25.68 0 top

### Tracks (layer width: path | path; a pad name or v marks a point on that pad's centre or on a via)
2GND
  Top 0.61: 3.21,28.63 USB.MTN1 | USB.MTN2 9.55,27.59 L7.1
  Top 0.813: USB.MTN4 9.11,19.27 8.97,19.27 8.9,19.34 USB.MTN3 USB.MTN1 USB.MTN2 7.18,28.34
  pour Top: 1.86,29.78 10.49,29.78 10.49,26.76 7.96,26.76 7.96,20.79 10.49,20.79 10.49,17.87 1.86,17.87
12_IN
  Top 0.61: U$6.P$3 U$6.P$4
  Top 0.813: U$6.P$3 10.54,16.49 Q1.3
+3V3  (via drill 0.61)
  Top 0.127: 49.71,27.33 IC2.44
  Top 0.254: 49.72,28.15 IC2.44 49.72,22.21 48.99,21.48 C1.1 49.5,20.37 | 49.72,36.18 49.73,36.19 | 43.03,26.99 C20.1 | MEM.3 60.45,42.04 | 60.45,42.55 60.45,42.04 | 60.45,42.04 v59.31,42.04 | R9.2 39.9,45.82 40.12,45.59
  Top 0.305: 49.72,36.18 IC2.17 49.72,34.61 47.5,32.38 47.5,30.65 47.75,30.4 47.75,28.84 49.03,28.84 49.72,28.15 | 49.73,36.19 49.73,36.7 50.96,37.93 C3.2 50.94,43.1 v52.83,45.09 | 60.45,42.55 MEM.6 | 40.12,45.59 RTC.8 | LED1.A 19.51,12.5 27.8,12.5 30.3,10 | 49.5,20.37 50.4,19.47 50.4,19.1 51,18.5 52.5,18.5 53.32,17.68 v53.29,17.68 54.37,16.6 56,16.6 58.86,19.46 L6.2 | 45.8,28.8 45.76,28.84 IC2.36
  Top 0.406: 29.59,4.19 29.72,4.06 | v44.96,27.26 45.8,28.1 45.8,28.8 45.84,28.84 47.75,28.84
  Top 0.61: 30.55,2.61 HEADER_POWER.2 | v38.47,44.63 39.43,45.59 40.12,45.59 | 39.5,39.42 v38.44,40.48 | R13.2 39.5,38.83 R12.2 38.62,33.69 v38.99,33.35 38.99,32.79 37.99,31.79 T_SD.2 | v44.96,27.26 44.56,26.86 C20.1 42.91,26.4 41.1,26.4 35.23,20.53 35.23,13.48
  Top 0.813: 30.55,2.61 30.55,3.23 29.72,4.06 29.38,4.4 D2.C 29.38,7.67 R1.2 29.82,9.52 30.3,10 33.65,13.35 C3V.1 35.23,13.48 LDO.OUT | R13.2 39.5,39.42
  Bottom 0.305: ICSP!.1 61.77,20.54 57.83,16.6 54.4,16.6 53.32,17.68 v53.29,17.68 | v59.31,42.04 56.26,45.09 v52.83,45.09
  Bottom 0.61: 30.55,3.5 30.55,2.61 HEADER_POWER.2 | v38.47,44.63 39.68,43.41 39.68,41.73 v38.44,40.48 | 38.99,33.31 v38.99,33.35 43.45,33.35 46.1,30.7 46.1,28.4 v44.96,27.26
  Bottom 0.813: HEADER_POWER.4 35.56,3.56 34.4,4.72 31.77,4.72 30.55,3.5
+5V  (via drill 0.61)
  Top 0.61: v63.88,12.57 64.64,12.57 67.31,15.24 67.31,24.13 67.82,24.64 67.82,28.83 ICSP.2 | 38.1,2.92 38.1,3.2 39.8,4.9 43.6,4.9 46,7.3 52.77,7.3 v58.04,12.57
  Top 0.813: HEADER_POWER.5 38.1,2.92
  Bottom 0.61: v58.04,12.57 v63.88,12.57
GND  (via drill 0.61)
  Top 0.254: IC2.42 48.72,23.11 45.78,20.17 | C19.2 47.37,18.59
  Top 0.305: HEADER_POWER.6 HEADER_POWER.7 | IC2.35 44.07,29.34 C20.2 | IC2.5 53.89,30.84 v55.79,28.94 | C1.2 47.4,18.59 C19.2 46.44,18.57 45.78,19.22 | 45.78,20.17 45.78,19.22 | 45.78,19.22 C8.2 | IC2.18 49.22,38.56 C3.1 | C23.1 52.15,22.55 53.26,21.44 v54.07,21.44
  Top 0.406: 20.99,2.32 RESET.1 | C1B.1 3.76,34.5 C3B.1 | RF_A.3 32.83,33.97 33.4,33.4 33.4,32.1 32.8,31.5 RF_A.1 | RF_A.7 32.65,39.05 33,38.7 33.79,38.7 R6A.1 | C1A.1 24.2,26.69 C3A.1 | C26.2 14.25,26.35 13.76,26.84 L7.2
  Top 0.61: U$6.P$1 U$6.P$2 | 14.68,40.92 C2B.1 15.04,40.99 R6B.1
  Top 0.813: U$6.P$1 9.69,13.49 Q1.1
  Bottom 0.406: v35.2,38.3 34.81,39.5 G1.-
  Bottom 0.61: v13.9,43.35 13.95,43.4 16.5,43.4 17.8,44.7 18.2,44.7
  other vias: 35.67,9.15 63.72,10.22 46.36,16.26 28.22,46.55 32.37,30.02 20.04,24.82 59.91,5.27 3.3,32.12 4.54,9.46 3.96,15.06 11.43,22.44 46.05,9.93 48.24,1.59 42.77,16.34 33.1,18.87 30.22,12.76 57.78,10.03 55.2,14.4 41.32,27.77 7.75,2.37 18.04,2.37 41.1,31.08 27.35,4.64 56.61,37.29 37.61,39.21 49.22,40.59 61.97,34.26 59.82,47.14 50.17,29.44 50.89,32.82 30.16,44.24 52.72,48.45 22.22,48.05 13.8,30.85 16,33.55 23.4,19.37 17.7,21.47 19.5,20.67 21.4,19.87 21.64,24.02 23.34,23.42 39.5,30.48 39.4,26.58 37.2,24.58 35.7,23.28 42.75,8.63 9.9,48.55 52.32,41.59
  pour Bottom (isolate 0.254, rank 2): 0.2,53.2 64.4,53.2 66,51.6 66,40.3 68.5,37.8 68.6,5 66,2.4 66,0 0.2,0
  pour Top (isolate 0.305): 0.4,53 64.5,53 65.8,51.7 65.8,40.2 68.3,37.7 68.3,5.2 65.8,2.7 65.8,0.8 65.3,0.3 0.8,0.3 0.3,0.8 0.3,52.7 0.5,52.9
N$1
  Top 0.305: LED1.C 17.36,14.01
  Top 0.406: 17.36,14.01 R6.1
N$2
  Top 0.406: RTC.2 32.79,44.32 Y1.P$4
N$3
  Top 0.406: RTC.1 33.06,45.59 Y1.P$1
N$4  (via drill 0.61)
  Top 0.406: v19.62,37.38 19.88,37.12 19.88,36 20.45,36 C22_1.+ 22.62,35.5 23.38,36.25 24.26,36.25 24.26,36.51 | 24.26,36.51 R7.2 | RF_A.12 24.26,36.51 | RF_B.12 7.71,42.01 8.2,42.5 v9.38,42.5
  Bottom 0.406: v9.38,42.5 12,39.75 17.12,39.75 v19.62,37.38
N$5
  Top 0.406: RF_A.16 24.73,29.76 C3A.2
N$10
  Top 0.254: IC2.6 54.94,31.34 58.1,28.17 C21.1 58.86,26.82 L6.1
N$11
  Top 0.406: RF_A.4 32.96,35.24 33.4,34.8 34.17,34.8 CNA.2
N$12
  Top 0.406: CNA.1 C2A.2 36.5,39.8 35.81,40.49 R6A.2 | R6A.2 33.77,40.73 | D5A.P$1 29.73,41.77 30.3,41.3 32.7,41.3 33.51,40.49 R6A.2
N$13
  Top 0.305: D3A.P$1 D2A.P$2 | 23.1,28.59 22.54,28.02 C1A.2
  Top 0.406: D3A.P$1 18.32,36.92 18.75,36.5 18.75,34 19.74,33.01 22.09,33.01 R3A.2 R4A.1 23.1,30.73 23.1,28.59
N$14  (via drill 0.61)
  Top 0.61: R5A.2 17.45,49.01 v17.45,49.15
  Bottom 0.61: v17.45,49.15 17.1,48.8 14.38,48.75 12.88,50.25 12.88,51 12,51.88 10.12,51.88 8.73,50.48 J2.2
N$15
  Top 0.61: R5B.2 2.74,46.84 J3.1
N$17
  Top 0.813: Q1.2 11.94,12.69 11.12,11.88 10,11.88 7.88,9.75 7.17,9.75 U$9.P$1
N$18
  Top 0.406: R1A.2 19.93,41.99 D2A.P$1 20.15,40.98 D1A.P$1
N$19
  Top 0.406: C3B.2 6.26,36.67 RF_B.16
N$20
  Top 0.406: D3A.P$2 D4A.P$2 21.57,39.67 22.56,40.66 R2A.1
N$21
  Top 0.61: RF_B.4 13.13,40.74 13.62,40.25 13.62,39.75 14.25,39.12 CNB.2
N$22
  Top 0.61: CNB.1 C2B.2 R6B.2 16.81,44.29 D5B.P$1
N$23
  Top 0.61: RF_B.9 4.57,45.82 | 4.57,45.82 R5B.1 | 4.57,45.82 4.57,44.74 D4B.P$1
N$24  (via drill 0.61)
  Top 0.406: v6.62,47.12 8.38,47.12 9.68,45.82 RF_B.8 13.07,45.82 13.7,46.45 CAB.2
  Top 0.61: v2.62,41.88 2.62,42.83 D1B.P$2
  Bottom 0.406: v2.62,41.88 6.62,45.88 v6.62,47.12
N$25
  Top 0.61: R1B.1 1.25,47.9 J3.2 5.23,51.88 12,51.88 12.88,51 12.88,49.46 CAB.1 13.94,48.8 15.95,48.8 17.19,47.56 R2B.2 17.19,46.16 D5B.P$2
N$26
  Top 0.406: R4B.2 3.5,36 5.7,38.2 RF_B.15
N$27
  Top 0.406: 8.38,39.47 RF_B.14 5.47,39.47 4.88,38.88 4.88,38.62 3.75,37.5 R3B.1 | 8.38,39.47 8.38,33.38 C22_4.+ | RF_B.6 RF_B.5 10.51,42.01 10,41.5 10,40.38 9.1,39.47 8.38,39.47
N$28
  Top 0.406: R1B.2 1.25,44.62 1.32,44.55
  Top 0.61: 1.25,44.62 1.25,41.05 D2B.P$1 | D1B.P$1 1.32,44.55
N$29  (via drill 0.61)
  Top 0.406: v15.53,45.52 15.51,47.11 R2B.1
  Top 0.61: D4B.P$2 v4.38,41.88 4.38,41.25 3.67,40.55 D3B.P$2
  Bottom 0.406: v4.38,41.88 7.12,44.62 7.12,45.12 9.25,47.25 v11.5,47.25 13.12,45.52 v15.53,45.52
N$30
  Top 0.406: C1B.2 R4B.1 R3B.2 1.32,37.79 1.32,38.52 D2B.P$2 D3B.P$1
N$35  (via drill 0.61)
  Top 0.406: D4A.P$1 24.27,39.29 25.3,40.32 | v18.18,43.1 18.4,43.33 18.4,45.59 R5A.1 18.45,45.75
  Top 0.61: RF_A.9 25.3,40.32 v24.5,41.12
  Bottom 0.61: v18.18,43.1 18.8,42.48 23.2,42.48 v24.5,41.12
N$40  (via drill 0.61)
  Top 0.406: RF_A.8 31.53,40.25 v29.52,40.25 | D1A.P$2 21.05,43.55 v21.3,43.8 22.4,43.8 CAA.2
  Bottom 0.406: v29.52,40.25 28.02,41.75 25.75,41.75 23.7,43.8 v21.3,43.8
N$41  (via drill 0.61)
  Top 0.406: D5A.P$2 25.62,41.88 25.14,42.36 24.39,43 R2A.2 24.34,45.66 23.8,46.2 CAA.1 21.32,46.2 | R1A.1 19.36,44.24 21.32,46.2 | v20.52,47.58 20.52,47 21.32,46.2
  Bottom 0.61: J2.1 13.82,47.58 v20.52,47.58
N$43
  Top 0.406: R4A.2 24.45,31.82 25.32,32.7 RF_A.15
N$44
  Top 0.406: RF_A.6 RF_A.5 30.26,36.51 29.73,35.98 29.73,34.99 28.7,33.97 | R3A.1 24.27,33.1 25.14,33.97 RF_A.14 28.7,33.97 | C22_3.+ 29.59,27.88 29.59,27.91 28.7,28.8 28.7,33.97
PA00_XIN32
  Top 0.254: IC2.1 53.26,28.83 53.26,25.26 Y4.P$1 53.06,23.69 C23.2
PA01_XOUT32
  Top 0.254: IC2.2 53.76,29.34 54.23,28.87 54.23,27.1 56.16,25.16 Y4.P$2 56.16,23.57 C24.2
PA02_AIN0  (1 unrouted)
  Top 0.254: IC2.3 54.02,29.84 54.74,29.13 54.74,27.48 55.75,26.46 56.9,26.46 57.91,25.45 57.91,24.56 58.29,24.18 59.44,24.18 59.82,23.79 59.82,9.65 54.36,4.7 52.7,4.7 50.8,2.79
  Top 0.406: VDIV2.1 49.17,6.06 VDIV1.2 49.17,4.17
PA03_AREFA  (via drill 0.61)
  Top 0.254: IC2.4 52.38,30.34 52.07,30.65 52.07,34.34 56.26,38.53 | C5.+ 64.57,46.37 64.5,46.48
  Top 0.305: 56.26,38.53 56.26,46.74 57.88,48.35 60.71,48.35 C4.1 64.31,46.11 64.57,46.37 | 64.9,45.99 C5.+ 64.7,45.97 v64.7,48.6
  Bottom 0.305: HEADER_IOH.8 23.92,50.76 25.76,52.6 64.3,52.6 65,51.9 65,48.9 v64.7,48.6
PA04_AIN4
  Top 0.254: IC2.9 55.85,32.84 61.34,27.35 61.34,8.51 58.42,6.1 AD.4
  Top 0.305: AD.4 58.37,2.59
PA05_AIN5
  Top 0.254: IC2.10 55.98,33.34 61.85,27.48 61.85,3.43 AD.5
PA6_RFID_SHD  (via drill 0.61)
  Top 0.254: IC2.11 55.26,33.84 v55.75,34.34
  Top 0.406: v28.46,35.51 28.24,35.24 RF_A.13
  Bottom 0.305: HEADER_IOH.1 41.78,50.8 54.9,37.68 54.9,36.2 55.9,35.2 55.9,34.48 v55.75,34.34 55.26,33.84 53.66,33.84 51.3,36.2 31.3,36.2 30.61,35.51 v28.46,35.51
PA7_RFID_SHD2  (via drill 0.61)
  Top 0.254: IC2.12 53.6,34.34
  Top 0.305: 53.6,34.34 v54.23,34.97
  Top 0.406: RF_B.13 8.24,40.74 v8.5,41
  Bottom 0.305: 39.12,49.28 42.42,49.28 54.23,37.47 v54.23,34.97
  Bottom 0.406: HEADER_IOH.2 39.12,49.28 39.12,48.82 38.38,48.08 37.38,48.08 36.83,48.62 25.75,48.62 23.12,46 17.52,46 16.02,44.5 12.12,44.5 10.88,45.75 9.38,45.75 8.25,44.62 8.25,41.25 v8.5,41
PA08_TCC0-W0_PA8  (via drill 0.61)
  Top 0.254: IC2.13 51.82,35.87 54.99,39.03 54.99,47.37 HEADER_IOL.3
  Top 0.305: MEM.4 61.72,39.02 v63.12,40.42
  Bottom 0.305: v63.12,40.42 63.12,46.1 HEADER_IOL.3
PA09_TCC0-W1_PA9
  Top 0.254: IC2.14 51.22,36.41 51.44,36.62 51.82,36.62 54.36,39.16 54.36,47.62 55.88,49.15 HEADER_IOL.4
PA10_TCC0-W2_PA10
  Top 0.254: IC2.15 50.72,36.67 51.31,37.26 51.69,37.26 53.85,39.41 53.85,48.01 54.61,48.77 54.61,51.44 55.5,52.32 59.44,52.32 HEADER_IOL.2
  Bottom 0.305: 60.91,50.74 HEADER_IOL.2
PA11_TCC0-W3_PA11
  Top 0.254: IC2.16 50.22,35.04 50.55,34.72 51.69,34.72 52.58,35.6 52.58,35.86 55.63,38.91 55.63,47.12 57.78,49.28 61.98,49.28 HEADER_IOL.1
  Bottom 0.305: 63.57,50.73 HEADER_IOL.1
PA13
  Top 0.254: IC2.22 47.22,35.2 46.86,34.84 46.1,34.84 45.72,35.22 HEADER_IOL.8
PA14_TCC0-W4
  Top 0.254: IC2.23 46.72,45.96 49.91,49.15 51.69,49.15 HEADER_IOL.5
PA15_TCC0-W5
  Top 0.254: IC2.24 46.2,35.88 46.2,46.2 HEADER_IOL.6
PA16_MOSI
  Top 0.305: IC2.25 44.7,48.51 42.93,50.27 42.93,51.69 42.29,52.32 35.56,52.32 HEADER_IOH.4
PA17_SCK  (via drill 0.61)
  Top 0.254: IC2.26 44.69,33.83 | 44.68,33.83 IC2.26 | v37.85,49.15 v37.85,49.14 43.17,49.14 43.94,48.37 43.94,34.09 44.18,33.84 IC2.26
  Bottom 0.305: v37.85,49.15 37.72,49.28 30.48,49.28 HEADER_IOH.6
PA18_SS
  Top 0.254: IC2.27 43.92,33.34 43.43,33.83 43.43,47.99 42.8,48.62 38.88,48.62 38.38,48.12 37.47,48.12 36.58,49.02 HEADER_IOH.3
  Bottom 0.254: 36.53,50.75 HEADER_IOH.3
PA19_MISO
  Top 0.254: HEADER_IOH.5 32,50.79 33.51,49.28 35.64,49.28 37.25,47.67 38.67,47.67 39.12,48.12 42.42,48.12 42.92,47.62 42.92,33.58 43.66,32.84 IC2.28
PA20_TCC0-W6
  Top 0.254: IC2.29 44.71,32.33 45.44,32.33 45.72,32.61 45.72,34.46 45.21,34.97 45.21,48.75 44.45,49.51 44.45,51.56 45.21,52.32 46.74,52.32 HEADER_IOL.7
PA21_INT&SDCS  (via drill 0.61 pad 0.61)
  Top 0.254: IC2.30 43.9,31.84 42.41,33.32 42.41,39.88 42.42,41.01 42.42,44.38 | 42.42,44.38 42.42,46.44 R9.1 | RTC.7 42.37,44.32 42.42,44.38
  Top 0.305: RTC.7 39.61,44.32 v38.34,43.05
  Bottom 0.406: U$4.1 24.08,32.05 22.6,33.52 22.6,36.2 22.88,36.48 22.88,38 23.25,38.38 26.82,38.38 27.68,37.52 28.82,37.52 33.1,41.7 36.99,41.7 v38.34,43.05
PA22_SDA  (via drill 0.61)
  Top 0.254: IC2.31 43.63,31.34 42,32.98 42,36.4 41.27,37.12 R13.1 | RTC.5 41.07,41.72 | v38.27,46.26 38.37,46.51 37.75,47.12 37.12,47.12 35.48,48.77 33.25,48.77 32.65,49.38 23.35,49.38 21.93,50.8 HEADER_IOH.9
  Top 0.305: R13.1 41.27,40.26 v41.27,40.77 41.07,40.97 41.07,41.72
  Bottom 0.254: v38.27,46.26 41.27,43.25 v41.27,40.77
PA23_SCL
  Top 0.254: RTC.6 39.86,43.05 39.86,42.93 39.23,42.29 39.23,42.04 38.85,41.66 | IC2.32 43.37,30.84 41.5,32.71 41.5,36.1 40.4,37.2 R12.1 40.39,37.59 40.39,40.15 39.24,41.29 38.86,41.67 38.85,41.66 | 38.85,41.66 38.21,41.66 37.32,42.55 37.32,46.23 37.27,46.23 35.25,48.25 33,48.25 32.49,48.76 23.2,48.76 22.66,49.3 20.66,49.3 19.15,50.8 HEADER_IOH.10
PA27_TX_LED  (via drill 0.61)
  Top 0.305: IC2.39 47.22,25.02 45.2,23 42.1,23 41.1,24 40.3,24 36.7,20.4 v36.7,19.5 | R6.2 21.83,16.7 v33.9,16.7
  Bottom 0.305: v36.7,19.5 v33.9,16.7
PA28_2FETS  (via drill 0.61)
  Top 0.305: IC2.41 48.22,23.37 44.96,20.11 40.93,20.11 R10.2 40.69,22.16 v40.69,22.86
  Top 0.61: v35.3,28.65 35.73,28.65 T_SD.1
  Bottom 0.406: v35.3,28.56 v35.3,28.65 40.69,23.27 v40.69,22.86
PA30_SWCLK  (via drill 0.61)
  Top 0.254: IC2.45 50.22,20.95 v51.44,19.73
  Bottom 0.305: ICSP!.4 66.26,19.27 66.67,19.68 66.67,21.34 65.63,22.38 61.38,22.38 57.5,18.5 56.3,18.5 56,18.8 52.37,18.8 v51.44,19.73
PA31_SWDIO  (via drill 0.61)
  Top 0.254: IC2.46 50.72,21.97 v55.03,17.66
  Bottom 0.305: ICSP!.2 65.53,20.95 64.77,21.72 61.98,21.72 57.93,17.66 v55.03,17.66
PB02  (via drill 0.61)
  Top 0.254: IC2.47 51.22,22.48 54.05,19.66 v56.95,19.66 | v62.87,23.5 62.36,22.99 62.36,3.68 AD.6
  Bottom 0.305: v56.95,19.66 57.16,19.66 60.99,23.5 v62.87,23.5
PB03_RFIDIN  (via drill 0.61)
  Top 0.305: IC2.48 51.72,29.99 51.05,30.65 v51.05,31.16
  Top 0.406: RF_B.2 12.8,38.2 14.25,36.75 14.25,33.38 16,31.62 18.25,31.62 18.75,31.12 18.75,27.95 19.27,27.43 v20.02,27.43 | RF_A.2 29.9,32.7 29.6,32.4 29.6,30.39 v30.23,29.76
  Bottom 0.406: v51.05,31.16 47.99,31.26 44.45,34.8 32.4,34.7 30.23,32.53 v30.23,29.76 28.72,28.25 20.85,28.25 v20.02,27.43
PB08_AIN2
  Top 0.254: IC2.7 55.33,31.84 60.33,26.84 60.33,9.27 53.34,2.79 AD.2
  Top 0.305: AD.2 53.37,2.56
PB09_AIN3
  Top 0.254: IC2.8 55.59,32.34 60.83,27.1 60.83,8.89 55.88,4.45 AD.3
PB10_S4_SPI_MOSI  (via drill 0.61)
  Top 0.305: v47.12,33.83 47.62,33.83 48.72,34.92 IC2.19 | MEM.1 57.91,35.17 v57.89,35.15
  Bottom 0.305: 28.6,29.8 U$4.2 28.88,29.55 28.88,32.78 31.7,35.6 45.34,35.6 v47.12,33.83 | 46.99,33.83 v47.12,33.83 | ICSP.4 66.17,28.53 64.9,29.8 64.9,31.74 63.74,32.9 57.9,32.9 | 57.9,32.9 52.6,32.9 51.5,34 47.29,34 v47.12,33.83 | v57.89,35.15 57.89,32.91 57.9,32.9
PB11_S4_SPI_SCK  (via drill 0.6, 0.61)
  Top 0.254: IC2.20 48.22,36.86 47.8,37.28 47.8,45.11 48.92,46.23 v49.91,46.23
  Top 0.305: MEM.2 59.18,38.35 | v57.66,41.53 58.04,41.15 58.42,41.15 59.18,40.39 MEM.2 | ICSP.3 59.18,32.38 MEM.2
  Bottom 0.305: v49.91,46.23 49.91,45.47 53.09,42.29 56.9,42.29 v57.66,41.53 | ICSP.3 57.16,21.48 56,21.48 54.75,20.23 53.5,20.23 52.02,21.7 27.15,21.7 U$4.5
PB12_S4_SPI_MISO  (via drill 0.61)
  Top 0.254: IC2.21 47.72,36.52 47.28,36.96 47.28,45.69 48.83,47.24 v51.56,47.24 | MEM.8 v57.91,46.61
  Top 0.305: v63.12,36.7 63.75,36.07 63.75,30.6 ICSP.1
  Bottom 0.254: v57.91,46.61 57.28,47.24 v51.56,47.24
  Bottom 0.305: ICSP.1 63.63,30.23 64.9,28.96 64.9,27.3 64.26,26.67 63.17,26.67 57.3,20.8 56.2,20.8 55,19.6 53.12,19.6 51.73,21 32.7,21 28.75,17.05 U$4.7 | v57.91,46.61 61.47,43.05 61.47,38.35 v63.12,36.7
PB22_DEBUG_TX
  Top 0.305: IC2.37 46.22,26.83 45.21,25.83 43.73,25.83 TP2.TP
PB23_DEBUG_RX
  Top 0.305: IC2.38 46.72,26.39 44.83,24.5 TP1.TP
RESET  (via drill 0.61)
  Top 0.305: RESET.4 25.91,10.01 25.91,2.54 25.49,2.12 RESET.3 | R2.2 44.1,17.25 44.1,9.2 45.2,8.1 45.2,8
  Top 0.406: RESET.3 26.75,0.76 31.24,0.76 HEADER_POWER.3 | D2.A 43.02,5.82 45.2,8 45.4,8.2 51.89,8.2 v58.04,14.35
  Top 0.61: 33.02,5.82 D2.A | D2.A 32.78,7.79 31.77,8.81 R1.1 | HEADER_POWER.3 33.02,5.58 D2.A
  Bottom 0.406: ICSP.5 63.75,25.27 63.75,24.64 64.52,23.88 65.15,23.88 67.31,21.69 67.31,16.13 66.64,15.46 ICSP!.10 65.53,14.72 65.16,14.35 v58.04,14.35
TARGET_RESET
  Top 0.305: IC2.40 47.72,23.64 45.09,21 C8.1 R2.1
TARGET_USB_N
  Top 0.254: 44.29,30.34 IC2.33 arc17 43.4,30.3 arc22 38.6,28.4 arc13 35.9,26.2 arc-20 31.3,22.9 arc-56 19.4,23.4 arc29 15.5,24.6 8.84,24.6 USB.D- | Z6.1 15.7,25.64
  Top 0.305: 15.7,25.64 15.5,25.44 15.5,24.6
TARGET_USB_P
  Top 0.254: IC2.34 IC2.34 arc90 IC2.34 | USB.D+ 8.87,23.9 13.6,23.9 | 13.6,23.9 15.3,23.9 arc-27 19.7,22.3 arc67 34.5,24 arc1 37.8,26.8 arc-25 42.4,29.5 arc-19 IC2.34 | Z5.1 13.56,23.86 13.6,23.9
V_IN  (via drill 0.61)
  Top 0.406: R7.1 v21.5,37.38 | RF_B.10 RF_B.11 6.55,43.25 7.62,43.25 8.62,44.25 v9.5,44.25 | VDIV2.2 46.61,6.09 45.72,5.2 HEADER_POWER.8
  Top 0.61: C22_2.+ 20.5,30.45 v20.5,31.62 | RF_A.11 27.4,37.78 v28.2,38.65 27.8,39.05 RF_A.10
  Top 0.813: v38.8,7.8 38.8,11.4 | 38.8,11.4 LDO.IN | 38.8,11.4 42.45,11.4 C12V.1
  Bottom 0.813: 10.75,9 12.25,7.5 12.25,5.2 12.75,4.7 20.44,4.7 21.68,5.86 21.91,6.1 38.8,6.1 | HEADER_POWER.8 45.72,6.1 38.8,6.1 | v9.5,44.25 13,40.75 17.5,40.75 19,39.25 21.5,39.25 | 21.5,39.25 v21.5,37.38 21.5,32.62 v20.5,31.62 15.4,26.62 15.4,13.74 10.75,9 | U$9.P$3 10.75,9 | v38.8,7.8 38.8,6.1 | v28.2,38.65 27.6,39.25 21.5,39.25
VBAT1  (via drill 0.61)  (1 unrouted)
  Top 0.406: RTC.3 33.95,43.05 v33.7,43
  Bottom 0.406: v33.7,43 33.7,44.42 G1.+@2
VDD  (via drill 0.61)
  Top 0.61: 34.87,30.94 T_SD.3 33.88,29.95 v33.88,27.59
  Bottom 0.61: U$4.4 31.45,24.55 33.88,26.98 v33.88,27.59
VDDCORE
  Top 0.254: IC2.43 49.22,22.59 47.37,20.74 C19.1
XUSB  (via drill 0.61)
  Top 0.305: v11,25.74 11.97,25.69 C26.1
  Top 0.406: USB.VBUS 10.7,25.44 v11,25.74 11.05,25.69
  Top 0.508: 11.42,25.77 v11,25.74
  Top 0.813: U$9.P$5 14.4,18.43 v13,19.82
  Bottom 0.813: v13,19.82 13,23.75 v11,25.74

### Text on the board
tPlace: IOREF | RESET | 3V3 | GND | GND | VIN | ADC / A0 | A1 | A2 | A3 | A4 | A5
tNames: SCL | SDA | AREF | GND | 12 | 7 | 6 | 5 | 4 | 3 | 2 | 13 | 11 | 10 | 9 | 8 | TX / 1 | RX / 0 | Pin 1 -> | + | <- BATTERY + | ON USB-> | - | <-ON BATTERY
ReferenceLC: ON
214bmp: D:/SmartProjects/Snc/a4_bn_logo2.bmp